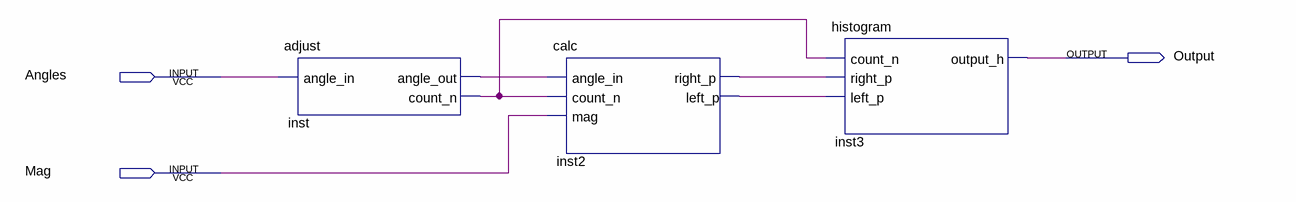
[diagram p0: schematic sheet]
// Quartus schematic human_detector.bdf as structural Verilog: 3 symbols, 3 pins
module human_detector (
  input  Angles,
  input  Mag,
  output Output
);

  wire inst2_left_p, inst2_right_p, inst_angle_out, inst_count_n;

  adjust inst (.angle_in(Angles), .angle_out(inst_angle_out), .count_n(inst_count_n));
  calc inst2 (
    .angle_in(inst_angle_out), .count_n(inst_count_n), .mag(Mag), .right_p(inst2_right_p),
    .left_p(inst2_left_p));
  histogram inst3 (.count_n(inst_count_n), .right_p(inst2_right_p), .left_p(inst2_left_p), .output_h(Output));
endmodule
